# EAGLE design board1 (EAGLE 7.5.0)
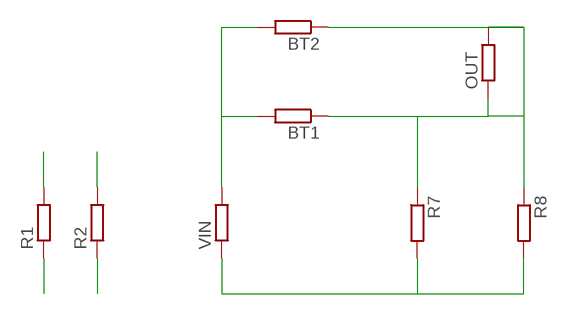
[diagram p0: schematic, sheet 1]

## Parts
BT1  R-EU_0204/2V  [0204V]
BT2  R-EU_0204/2V  [0204V]
OUT  R-EU_0204/5  [0204/5]
R1  R-EU_0204/2V  [0204V]
R2  R-EU_0204/2V  [0204V]
R7  R-EU_0204/2V  [0204V]
R8  R-EU_0204/2V  [0204V]
VIN  R-EU_0204/2V  [0204V]

## Nets
CLKI: R2.2
CLKO: R2.1
DTI: R1.2
DTO: R1.1
GROUND: R7.2 R8.2 VIN.1
N$1: BT1.2 BT2.2 VIN.2
N$2: BT1.1 OUT.1 R7.1
N$3: BT2.1 OUT.2 R8.1

## Library data of the parts
BT1 BT2 R1 R2 R7 R8 VIN = resistor:R-EU_: RESISTOR, European symbol
OUT = rcl:R-EU_: RESISTOR, European symbol

## Board
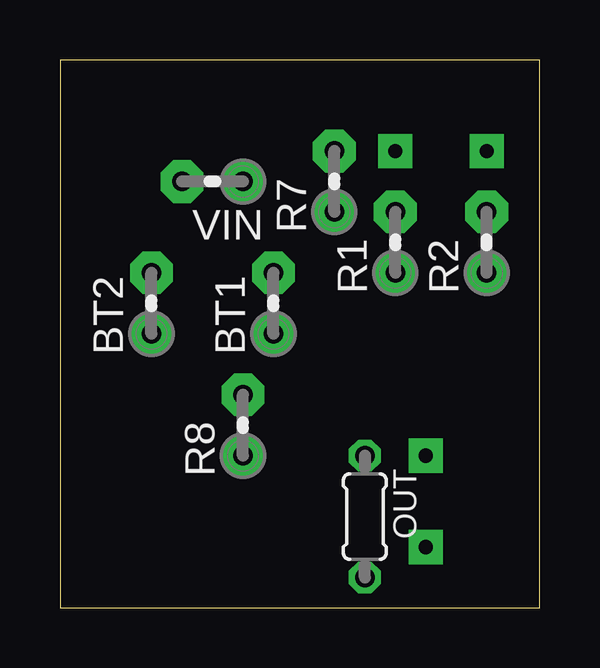
[diagram p1: board, top side]
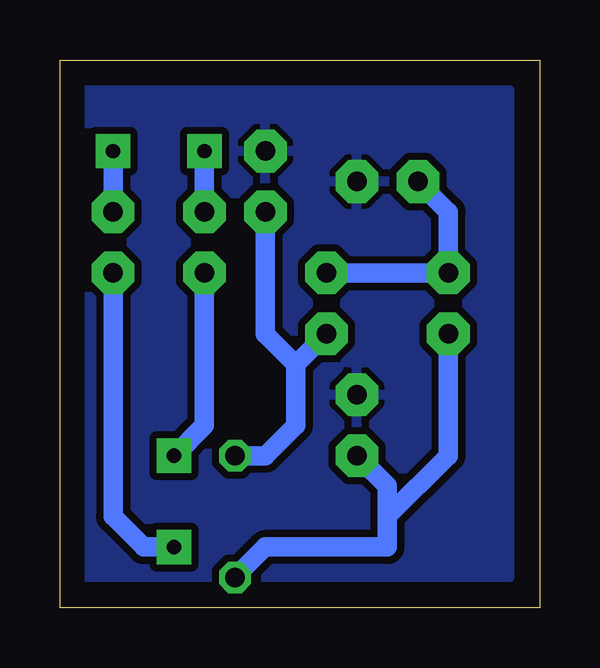
[diagram p2: board, bottom side, seen from below]

Size 19.99 x 22.85 mm. Coordinates in mm from the lower left corner, seen from the top.
Outline: 0,0 19.99,0 19.99,22.85 0,22.85 0,0
Copper layers (1*16): Top 0.035mm / dielectric 1.5mm / Bottom 0.035mm
Design rules "default": minimum track width 10mil, minimum drill 24mil, track to track 8mil, track to pad 8mil, pad to pad 8mil, via to via 8mil, smd to smd 8mil, copper to edge 40mil, drill to drill 8mil, minimum pad ring 10mil, minimum via ring 8mil, stop-mask expansion 4mil, vias tented up to drill 0mil, thermal gap 10mil

### Footprints (pad centres in the part's own frame; a part is rotated, then mirrored left to right if it is on the bottom)
0204V = drill 0.813 pad 1.778 octagon: 1 -1.27,0; 2 1.27,0
0204/5 = drill 0.813 octagon: 1 -2.54,0; 2 2.54,0

### Placement (x,y rotation side)
BT1  8.89,12.7 90 top
BT2  3.81,12.7 90 top
OUT  12.7,3.81 270 top
R1  13.97,15.24 90 top
R2  17.78,15.24 90 top
R7  11.43,17.78 90 top
R8  7.62,7.62 90 top
VIN  6.35,17.78 180 top

### Tracks (layer width: path | path; a pad name or v marks a point on that pad's centre or on a via)
CLKI  (via drill 0.6 pad 1.42)
  Bottom 0.813: v17.78,19.05 R2.2
CLKO  (via drill 0.6 pad 1.42)
  Bottom 0.813: R2.1 17.78,3.81 16.51,2.54 v15.24,2.54
DTI  (via drill 0.6 pad 1.42)
  Bottom 0.813: v13.97,19.05 R1.2
DTO  (via drill 0.6 pad 1.42)
  Bottom 0.813: R1.1 13.97,7.62 v15.24,6.35
GROUND
  pour Bottom (isolate 0.305): 1.27,21.59 1.27,1.27 19.05,1.27 19.05,21.59
N$1
  Bottom 0.813: BT1.2 BT2.2 3.81,16.51 VIN.2
N$2
  Bottom 0.813: BT1.1 10.16,10.16 | R7.1 11.43,11.43 10.16,10.16 | 10.16,10.16 10.16,7.62 11.43,6.35 OUT.1
N$3
  Bottom 0.813: 6.35,3.81 6.35,2.54 11.43,2.54 OUT.2 | R8.1 6.35,5.08 6.35,3.81 | BT2.1 3.81,6.35 6.35,3.81